# EAGLE schematic Licznik_Geigera (EAGLE 9.2.0)
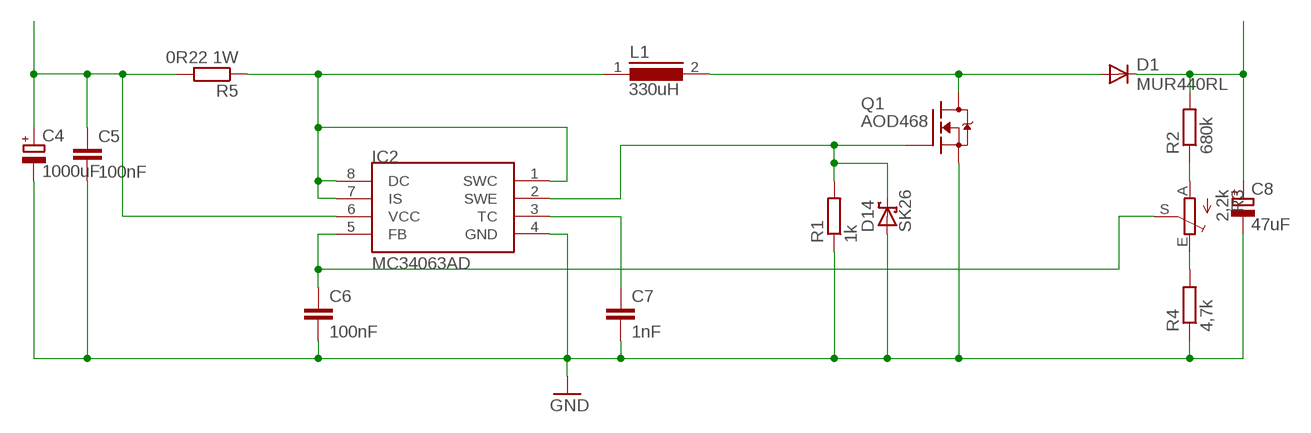
[diagram p0: schematic, sheet 1]

## Parts
C4  1000uF  CPOL-EUE5-10.5  [E5-10,5]
C5  100nF  C-EUC1206  [C1206]
C6  100nF  C-EUC1206  [C1206]
C7  1nF  C-EUC1206  [C1206]
C8  47uF  CPOL-EUE5-13  [E5-13]
D1  MUR440RL  [C2673]
D14  SK26  SCHOTTKY-DIODESMD  [SMB]
IC2  MC34063AD  [SOIC8]
L1  330uH  SFT830D  [SFT830D]
Q1  AOD468  [DPAK-TO252]
R1  1k  R-EU_R0805  [R0805]
R2  680k  R-EU_R0805  [R0805]
R3  2,2k  TRIM_EU-CA6V  [CA6V]
R4  4,7k  R-EU_R0805  [R0805]
R5  0R22 1W  R-EU_0411/15  [0411/15]

## Nets
GND: C4.- C5.2 C6.2 C7.2 C8.- D14.A IC2.4(GND) Q1.3(S) R1.1 R4.1
HV: C8.+ D1.C R2.2
N$1: IC2.1(SWC) IC2.7(IS) IC2.8(DC) L1.1 R5.1
N$2: C4.+ C5.1 IC2.6(VCC) R5.2
N$24: R2.1 R3.A
N$25: C7.1 IC2.3(TC)
N$26: R3.E R4.2
N$28: D14.C IC2.2(SWE) Q1.1(G) R1.2
N$29: D1.A L1.2 Q1.2(D)
N$30: C6.1 IC2.5(FB) R3.S

## Library data of the parts
C4 C8 = rcl:CPOL-EU: POLARIZED CAPACITOR, European symbol; SPICEPREFIX: C
C5-C7 = rcl:C-EU: CAPACITOR, European symbol; SPICEPREFIX: C
D1 = diode:MUR440RL: DIODE ultra-fast recovery rectifier, Vrrm = 40 V, 4 A
D14 = diode:SCHOTTKY-DIODE: Schottky Diode
IC2 = mc34063:MC34063
L1 = inductors:SFT830D: INDUCTOR; SPICEPREFIX: L
Q1 = tranzystory:AOD468
R1 R2 R4 R5 = rcl:R-EU_: RESISTOR, European symbol; SPICEPREFIX: R
R3 = pot:TRIM_EU-: POTENTIOMETER